# EAGLE design DebuggerKB (EAGLE 9.6.2)
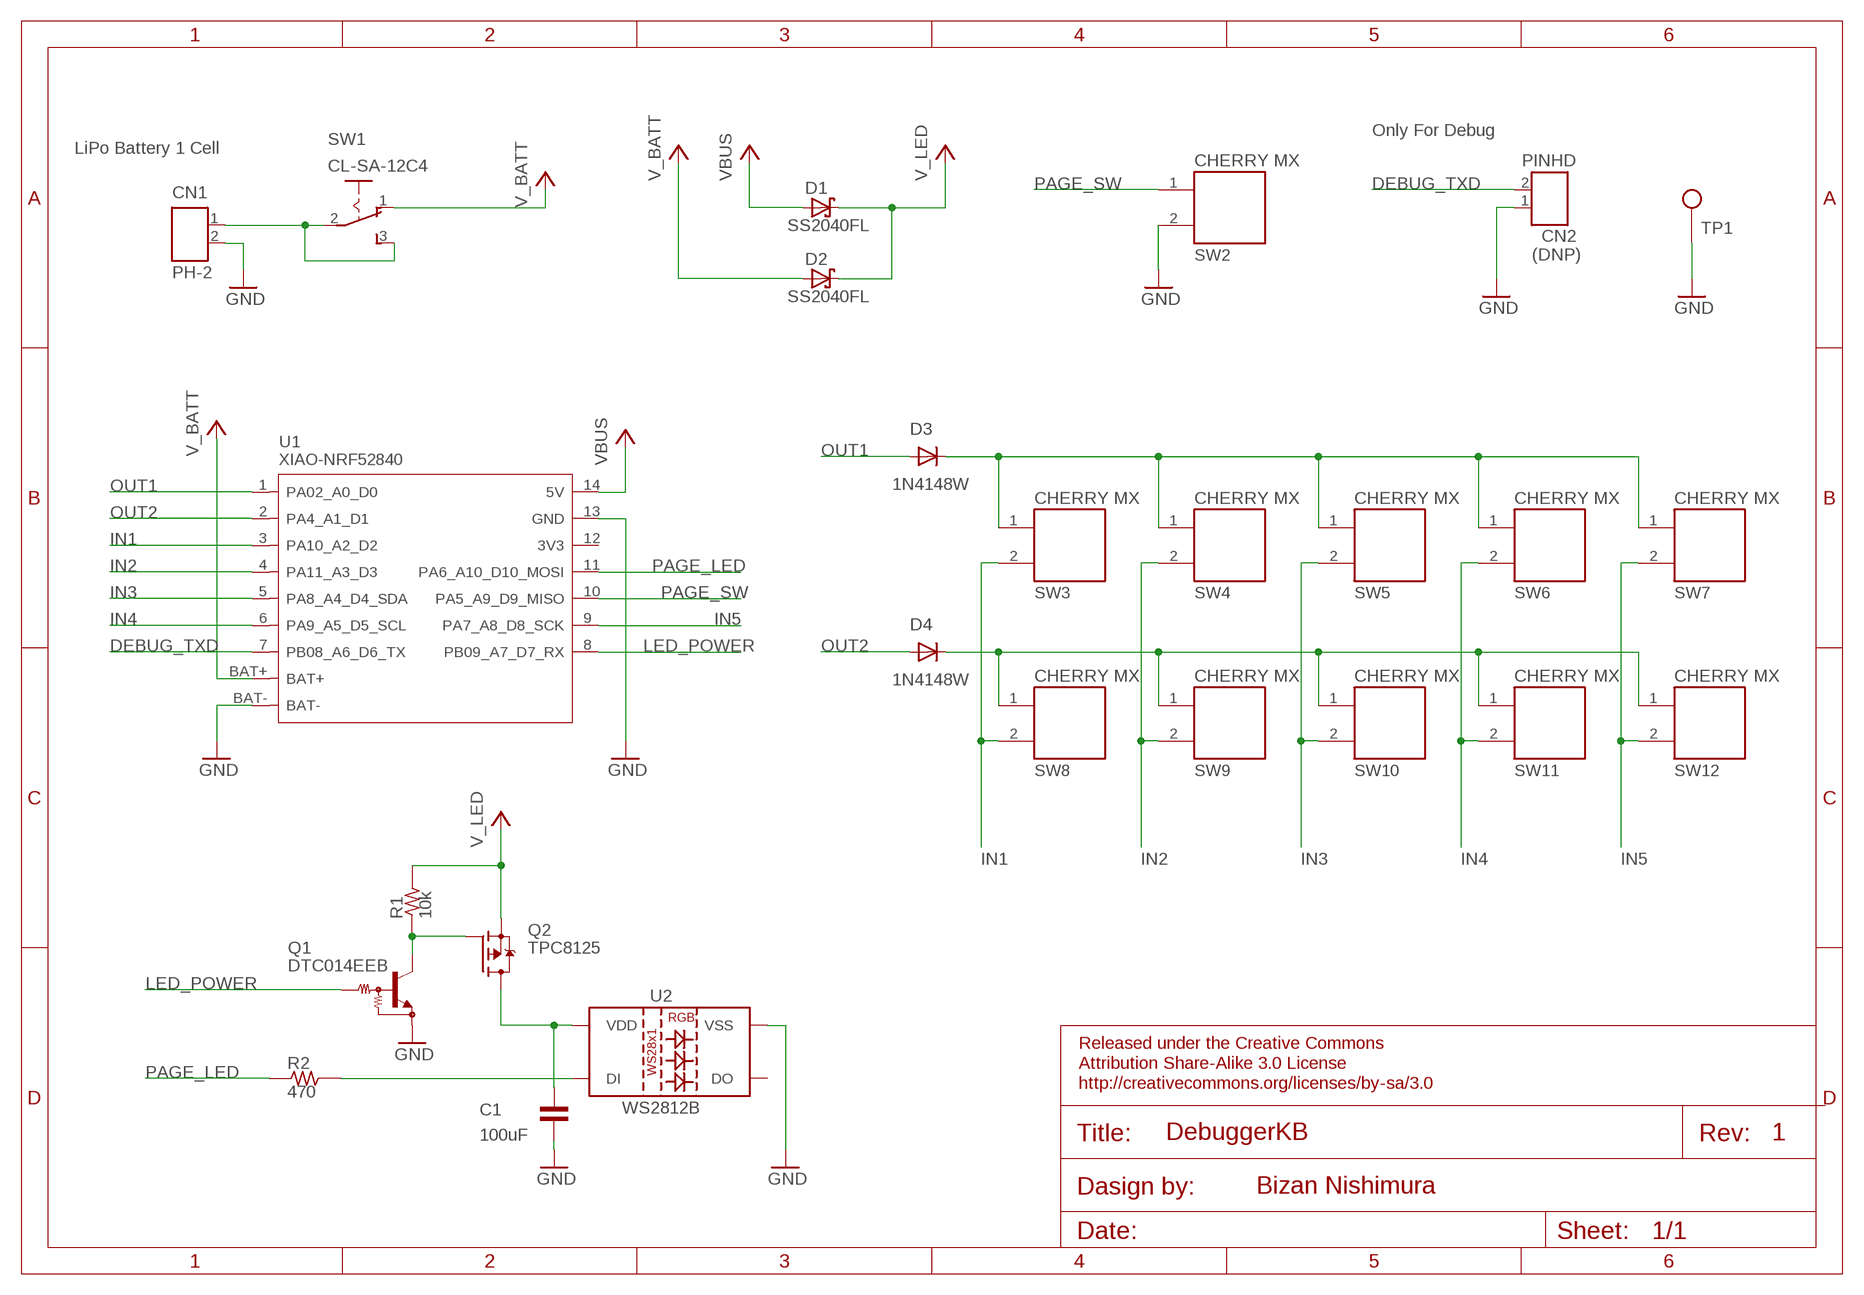
[diagram p0: schematic, sheet 1]

## Parts
C1  100uF  C-CP-3216  [CP3216]
CN1  PH-2  [PH-2]
CN2  PINHD  PINHD-1X2  [1X02]
D1  SS2040FL  SCHOTTKY-DIODE-SOD123  [SOD123]
D2  SS2040FL  SCHOTTKY-DIODE-SOD123  [SOD123]
D3  1N4148W  DIODE-SOD123  [SOD123]
D4  1N4148W  DIODE-SOD123  [SOD123]
Q1  DTC014EEB  DIGITORASC89  [SOT490]
Q2  TPC8125  [SO-8]
R1  10k  R-CP-1608  [CP1608]
R2  470  R-CP-1608  [CP1608]
SW1  CL-SA-12C4  [CL-SA-12C4]
SW2  KAILH_SWITCH_SOCKET  [SWITCH_SOCKET]
SW3  KAILH_SWITCH_SOCKET  [SWITCH_SOCKET]
SW4  KAILH_SWITCH_SOCKET  [SWITCH_SOCKET]
SW5  KAILH_SWITCH_SOCKET  [SWITCH_SOCKET]
SW6  KAILH_SWITCH_SOCKET  [SWITCH_SOCKET]
SW7  KAILH_SWITCH_SOCKET  [SWITCH_SOCKET]
SW8  KAILH_SWITCH_SOCKET  [SWITCH_SOCKET]
SW9  KAILH_SWITCH_SOCKET  [SWITCH_SOCKET]
SW10  KAILH_SWITCH_SOCKET  [SWITCH_SOCKET]
SW11  KAILH_SWITCH_SOCKET  [SWITCH_SOCKET]
SW12  KAILH_SWITCH_SOCKET  [SWITCH_SOCKET]
TP1  TEST_PIN  [TEST_PIN]
U1  XIAO-NRF52840  XIAO-NRF52840-BAT  [XIAO-NRF52840-BAT]
U2  WS2812B  [WS2812B]

## Nets
DEBUG_TXD: CN2.2 U1.7(PB08_A6_D6_TX)
GND: C1.SMD2(PIN2) CN1.2 CN2.1 Q1.2(E) SW2.2(PIN-2) TP1.1 U1.13(GND) U1.BAT- U2.3(VSS)
IN1: SW3.2(PIN-2) SW8.2(PIN-2) U1.3(PA10_A2_D2)
IN2: SW4.2(PIN-2) SW9.2(PIN-2) U1.4(PA11_A3_D3)
IN3: SW5.2(PIN-2) SW10.2(PIN-2) U1.5(PA8_A4_D4_SDA)
IN4: SW6.2(PIN-2) SW11.2(PIN-2) U1.6(PA9_A5_D5_SCL)
IN5: SW7.2(PIN-2) SW12.2(PIN-2) U1.9(PA7_A8_D8_SCK)
LED_POWER: Q1.1(B) U1.8(PB09_A7_D7_RX)
N$1: C1.SMD1(PIN1) Q2.5(D) Q2.6(D) Q2.7(D) Q2.8(D) U2.1(VDD)
N$2: CN1.1 SW1.2(P) SW1.3(S)
N$3: Q1.3(C) Q2.4(G) R1.SMD1(PIN1)
N$4: R2.SMD2(PIN2) U2.4(DI)
N$5: D3.C SW3.1(PIN-1) SW4.1(PIN-1) SW5.1(PIN-1) SW6.1(PIN-1) SW7.1(PIN-1)
N$6: D4.C SW8.1(PIN-1) SW9.1(PIN-1) SW10.1(PIN-1) SW11.1(PIN-1) SW12.1(PIN-1)
OUT1: D3.A U1.1(PA02_A0_D0)
OUT2: D4.A U1.2(PA4_A1_D1)
PAGE_LED: R2.SMD1(PIN1) U1.11(PA6_A10_D10_MOSI)
PAGE_SW: SW2.1(PIN-1) U1.10(PA5_A9_D9_MISO)
V_BATT: D2.A SW1.1(O) U1.BAT+
V_LED: D1.C D2.C Q2.1(S) Q2.2(S) Q2.3(S) R1.SMD2(PIN2)
VBUS: D1.A U1.14(5V)
Unconnected: U1.12(3V3) U2.2(DO)

## Notes on the sheet
- Only For Debug
- LiPo Battery 1 Cell
- (DNP)
- 1
- Bizan Nishimura

## Library data of the parts
C1 = lipoyang_cr:C-: CAPACITOR Japanese symbol
CN1 = lipoyang_mechanical:PH-2
CN2 = untitled:PINHD-1X2: PIN HEADER
D1 D2 = lipoyang_discrete:SCHOTTKY-DIODE: Schottky Diode
D3 D4 = lipoyang_discrete:DIODE-: DIODE
Q1 = lipoyang_discrete:DIGITORA: NPN Bias Resistor Transistor
Q2 = lipoyang_discrete:TPC8125: OptiMOS(R)-P Small-Signal-Transistor P-Channel, Enhancement mode, Super Logic Level (2.5 V rated) RDS(on) 8mOhm, ID -14.9 a Source: http://www.infineon.com/upload/Document/cmc_upload/documents/011/3655/BSO201SP_211201.pdf
R1 R2 = lipoyang_cr:R-: RESISTOR Japanese symbol
SW1 = lipoyang_mechanical:CL-SA-12C4: SLIDING SWITCH Mors, distributor Buerklin, 11G702
SW2-SW12 = lipoyang_mechanical:KAILH_SWITCH_SOCKET
TP1 = lipoyang_mechanical:TEST_PIN: Test Pin
U1 = lipoyang_rf:XIAO-NRF52840-BAT
U2 = lipoyang_ic:WS2812B: WS2812B SMD addressable RGB LED 5x5mm SMD LED with built-in controller IC. Color: Red/Green/Blue mC Rating: RGB: 390, 660, 180 mcd Forward Voltage: RGB: 2.0, 3.0, 3.0 V Packages:WS2812B SparkFun Products: Blynk Board - ESP8266 <https://www.sparkfun.com/products/13794>; PROD_ID: DIO-12503

## Board
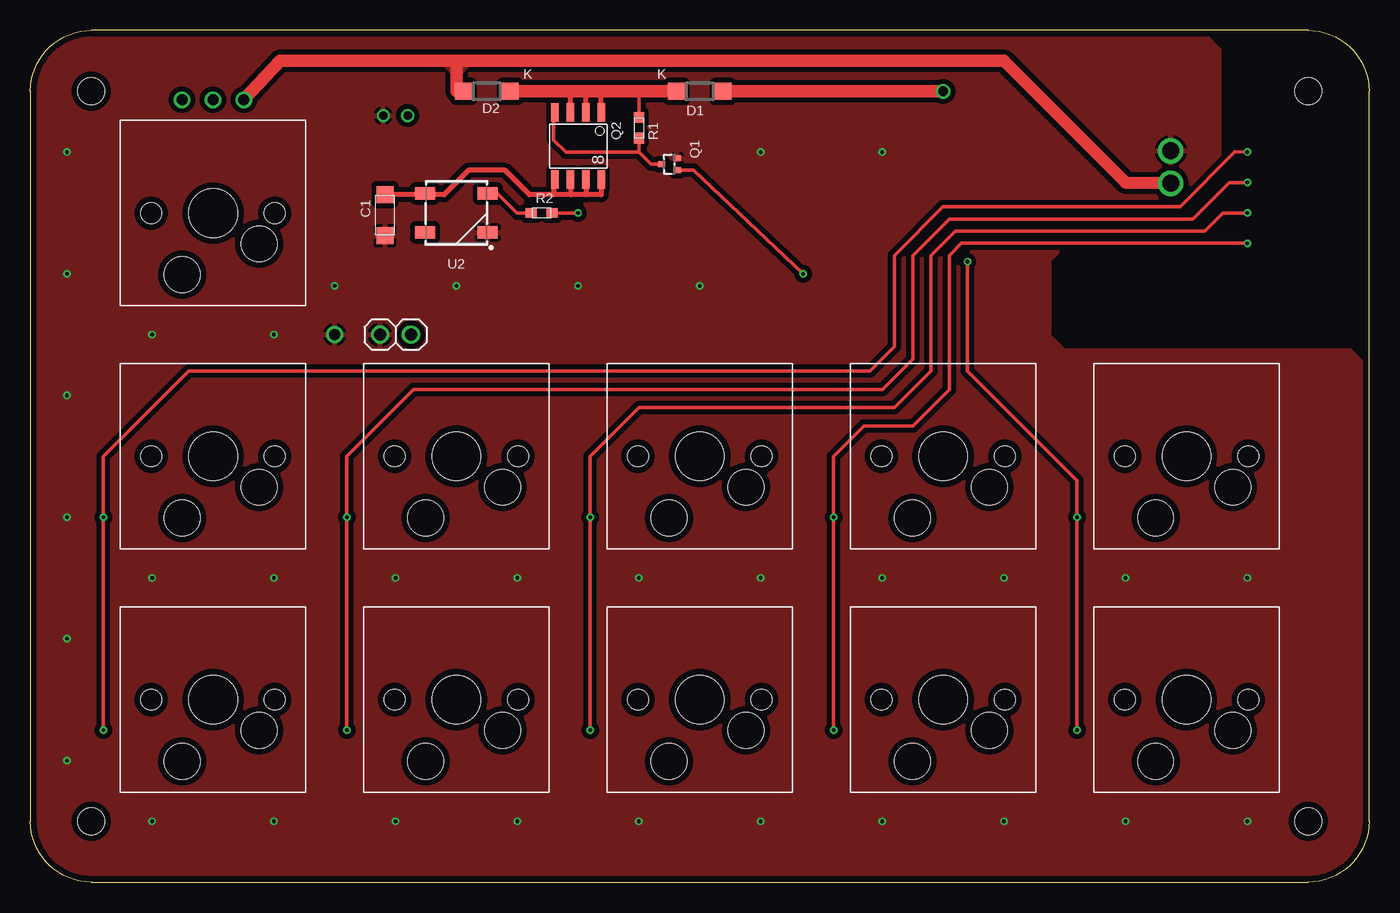
[diagram p1: board, top side]
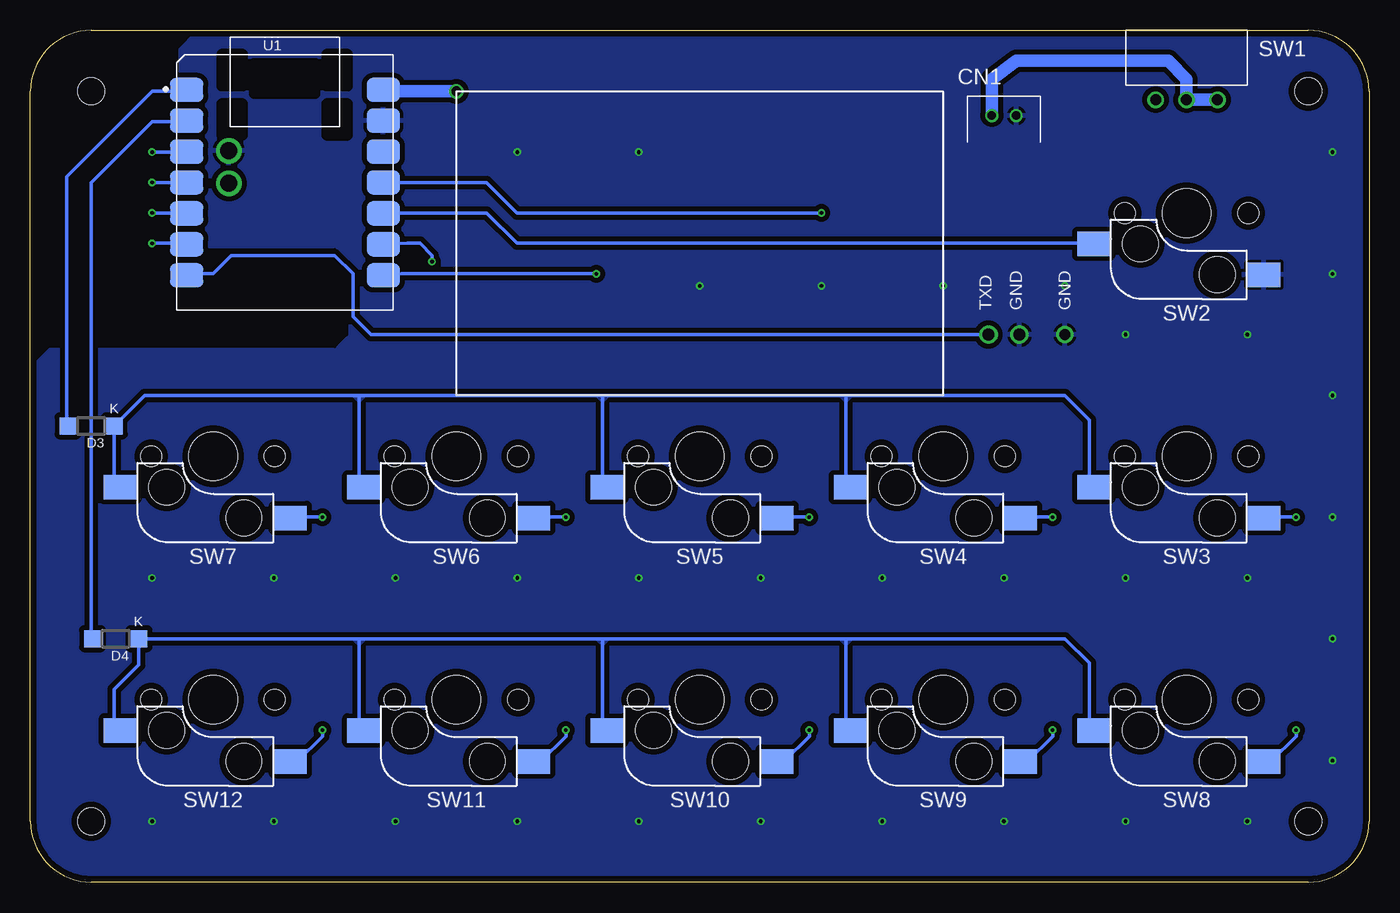
[diagram p2: board, bottom side, seen from below]

Size 110 x 70 mm. Coordinates in mm from the lower left corner, seen from the top.
Outline: 5,0 105,0 arc90 110,5 110,65 arc90 105,70 5,70 arc90 0,65 0,5 arc90 5,0
Copper layers (1*16): Top 0.035mm / dielectric 1.6mm / Bottom 0.035mm
Design rules "Elecrow_2-layer_PCB_eagle_rule": minimum track width 6mil, minimum drill 12mil, track to track 6mil, track to pad 6mil, pad to pad 6mil, via to via 8mil, smd to smd 0mil, copper to edge 20mil, drill to drill 10mil, minimum pad ring 6mil, minimum via ring 6mil, stop-mask expansion 0mil, vias tented up to drill 100mil, thermal gap 10mil
Holes 2.2 mm at 5,65 105,65 105,5 5,5

### Footprints (pad centres in the part's own frame; a part is rotated, then mirrored left to right if it is on the bottom)
CP3216 = smd 1.4 x 1.4: SMD1 -1.7,0; SMD2 1.7,0
PH-2 = drill 0.7: 1 -1,0; 2 1,0
1X02 = drill 1: 1 -1.27,0; 2 1.27,0
SOD123 = smd 1.4 x 1.4: A 1.9,0; C -1.9,0
SOT490 = smd 0.5 x 0.6: 1 -0.5,-0.65; 2 0.5,-0.65; 3 0,0.65
SO-8 = smd 1.524 x 0.61: 1 -2.743,1.905; 2 -2.743,0.635; 3 -2.743,-0.635; 4 -2.743,-1.905; 5 2.743,-1.905; 6 2.743,-0.635; 7 2.743,0.635; 8 2.743,1.905
CP1608 = smd 0.9 x 0.8: SMD1 -0.85,0; SMD2 0.85,0
CL-SA-12C4 = drill 0.9: 1 -2.54,0; 2 0,0; 3 2.54,0
SWITCH_SOCKET = smd 2.7 x 2 bottom: 1 -7.625,2.54; 2 6.355,5.08 | hole 4: 0,0 | hole 2.93: -3.81,2.54; 2.54,5.08 | hole 1.7: -5.08,0; 5.08,0
TEST_PIN = drill 0.914: 1 0,0
XIAO-NRF52840-BAT = smd 2.75 x 2: 1 0.835,18.12; 2 0.835,15.58; 3 0.835,13.04; 4 0.835,10.5; 5 0.835,7.96; 6 0.835,5.42; 7 0.835,2.88; 8 17,2.88; 9 17,5.42; 10 17,7.96; 11 17,10.5; 12 17,13.04; 13 17,15.58; 14 17,18.12 | drill 1.4: BAT+ 4.3,10.44; BAT- 4.3,13.1
WS2812B = smd 1.651 x 1: 1 2.577,-1.6; 2 2.577,1.6; 3 -2.577,1.6; 4 -2.577,-1.6

### Placement (x,y rotation side)
C1  29.14,54.82 270 top
CN1  30,63 0 bottom
CN2  30,45 0 top
D1  55,65 0 top
D2  37.5,65 180 top
D3  105,37.5 180 bottom
D4  103,20 180 bottom
Q1  52.5,59 90 top
Q2  45,60.5 270 top
R1  50,62 90 top
R2  42,55 180 top
SW1  15,64.3 0 bottom
SW2  15,55 180 top
SW3  15,35 180 top
SW4  35,35 180 top
SW5  55,35 180 top
SW6  75,35 180 top
SW7  95,35 180 top
SW8  15,15 180 top
SW9  35,15 180 top
SW10  55,15 180 top
SW11  75,15 180 top
SW12  95,15 180 top
TP1  25,45 0 bottom
U1  98,47 0 bottom
U2  35,55 180 top

### Tracks (layer width: path | path; a pad name or v marks a point on that pad's centre or on a via)
DEBUG_TXD
  Bottom 0.305: U1.7 96,50 95,50 93.5,51.5 85,51.5 83.5,50 83.5,46.5 82,45 CN2.2
GND  (via drill 0.3)
  other vias: 3,60 3,50 3,40 3,30 3,20 3,10 10,5 20,5 30,5 40,5 50,5 60,5 70,5 80,5 90,5 10,25 20,25 30,25 40,25 50,25 60,25 70,25 90,25 10,45 25,49 35,49 45,49 55,49 60,60 70,60 80,25 100,25 20,45 100,5
  pour Top (isolate 0.406): -5,75 -5,-5 115,-5 115,75
  pour Bottom (isolate 0.406): -2,71 -2,-2 112,-2 112,72 -2,72
  cutout Bottom (isolate 0.406): 110,70 96.5,70 98,68.5 98,52 85,52 84,51 84,45 85,44 108.5,44 110,42.5
IN1  (via drill 0.3)
  Top 0.305: v100,60 98.98,60.02 94.5,55.5 75,55.5 71,51.5 71,44 69,42 13,42 6,35 v6,30 v6,12.5
  Bottom 0.305: U1.3 98.5,60 v100,60 | v6,30 8.56,30 SW3.2 | SW8.2 8.08,9.92 6,12 v6,12.5
IN2  (via drill 0.3)
  Top 0.305: v100,57.5 98.5,57.5 95.5,54.5 75.5,54.5 72.5,51.5 72.5,43 70,40.5 31.5,40.5 26,35 v26,30 v26,12.5
  Bottom 0.305: U1.4 v100,57.5 | v26,30 28.57,30 SW4.2 | SW9.2 28.08,9.92 26,12 v26,12.5
IN3  (via drill 0.3)
  Top 0.305: v100,55 98,55 96.5,53.5 76,53.5 74,51.5 74,42 71,39 50,39 46,35 v46,30 v46,12.5
  Bottom 0.305: U1.5 98,55 v100,55 | v46,30 48.56,30 SW5.2 | SW10.2 48.08,9.92 46,12 v46,12.5
IN4  (via drill 0.3)
  Top 0.305: v100,52.5 76.5,52.5 75.5,51.5 75.5,40.5 72.5,37.5 68.5,37.5 66,35 v66,30 v66,12.5
  Bottom 0.305: v100,52.5 98,52.5 U1.6 | SW11.2 68.08,9.92 66,12 v66,12.5 | SW6.2 68.56,30 v66,30
IN5  (via drill 0.3)
  Top 0.305: v77,51 77,42 86,33 v86,30 v86,12.5
  Bottom 0.305: U1.9 79,52.5 78,52.5 77,51.5 v77,51 | v86,30 88.72,30 SW7.2 | SW12.2 88.08,9.92 86,12 v86,12.5
LED_POWER  (via drill 0.3)
  Top 0.305: v63.5,50 54.5,58.5 Q1.1
  Bottom 0.305: U1.8 79.5,50 65.75,50 v63.5,50
N$1
  Top 0.305: C1.SMD1 29.48,56.52 29.5,56.5 32.32,56.5 U2.1
  Top 0.406: Q2.5 43,57.5 43,56.5 | 43,56.5 41,56.5 39,58.5 36,58.5 34,56.5 29.5,56.5 | Q2.6 44.4,57.5 44.4,56.5 | 44.4,56.5 43,56.5 | Q2.7 45.65,57.5 45.65,56.5 | 45.65,56.5 44.4,56.5 | Q2.8 46.9,57.5 46.9,56.5 45.65,56.5
N$2
  Bottom 1.016: SW1.3 SW1.2 15,66 16.5,67.5 29,67.5 31,66 CN1.1
N$3
  Top 0.305: Q1.3 51,59 50,60 | 50,60 R1.SMD1 | Q2.4 43,63 43,61 44,60 50,60
N$4
  Top 0.305: R2.SMD2 40,55 38.24,56.76 U2.4
N$5
  Bottom 0.254: 103.1,32.94 SW7.1
  Bottom 0.305: 103.1,32.94 D3.C 100.6,40 83,40 | SW3.1 23,32.84 23,38 25,40 43,40 | 83,40 63,40 | 63,40 43,40 | SW4.1 43,32.84 43,40 | SW5.1 63,32.84 63,40 | SW6.1 83,32.84 83,40
  pour Bottom (rank 2): 43,39.5 43.5,40 42.5,40
  pour Bottom (rank 2): 63,39.5 62.5,40 63.5,40
  pour Bottom (rank 2): 83,39.5 82.5,40 83.5,40
N$6
  Bottom 0.305: SW12.1 103.12,12.96 103.12,15.85 101.1,17.88 D4.C 83,20 | 83,20 63,20 | 63,20 43,20 | 43,20 25,20 23,18 23,12 22.62,12.38 SW8.1 | SW9.1 42.62,12.62 43,13 43,20 | SW10.1 62.62,12.62 63,13 63,20 | SW11.1 82.62,12.62 83,13 83,20
  pour Bottom (rank 2): 83,19.5 82.5,20 83.5,20
  pour Bottom (rank 2): 63,19.5 62.5,20 63.5,20
  pour Bottom (rank 2): 43,19.5 42.5,20 43.5,20
N$7
  cutout Top (isolate 0.406): 110,70 96.5,70 98,68.5 98,52 85,52 84,51 84,45 85,44 108.5,44 110,42.5
OUT1
  Bottom 0.305: U1.1 98.5,65 100,65 107,58 107,37.6 D3.A
OUT2
  Bottom 0.305: U1.2 98.5,62.5 100,62.5 105,57.5 105,20.1 D4.A
PAGE_LED  (via drill 0.3)
  Top 0.305: v45,55 R2.SMD1
  Bottom 0.305: U1.11 72.5,57.5 70,55 v45,55
PAGE_SW
  Bottom 0.305: U1.10 80,55 72.5,55 70,52.5 22.66,52.5 SW2.1
V_BATT
  Top 1.016: SW1.1 20.5,67.5 35,67.5 | 35,67.5 80,67.5 90,57.5 U1.BAT+ | D2.A 35,65 35,67.5
  pour Top (rank 2): 34,67.5 36,67.5 35,66.5
V_LED
  Top 0.305: Q2.1 46.9,63 | Q2.2 45.65,63 | Q2.3 44.4,63 | R1.SMD2 50,65
  Top 0.406: 46.9,63 46.9,65 | 45.65,63 45.65,65 | 44.4,63 44.4,65
  Top 1.016: D2.C 44.4,65 45.65,65 46.9,65 50,65 D1.C
VBUS  (via drill 0.8)
  Top 1.016: D1.A v75,65
  Bottom 1.016: U1.14 80,65 v75,65

### Text on the board
tPlace: K | K
bPlace: GND | GND | TXD | K | K